# EAGLE schematic Memory Board (EAGLE 7.4.0)
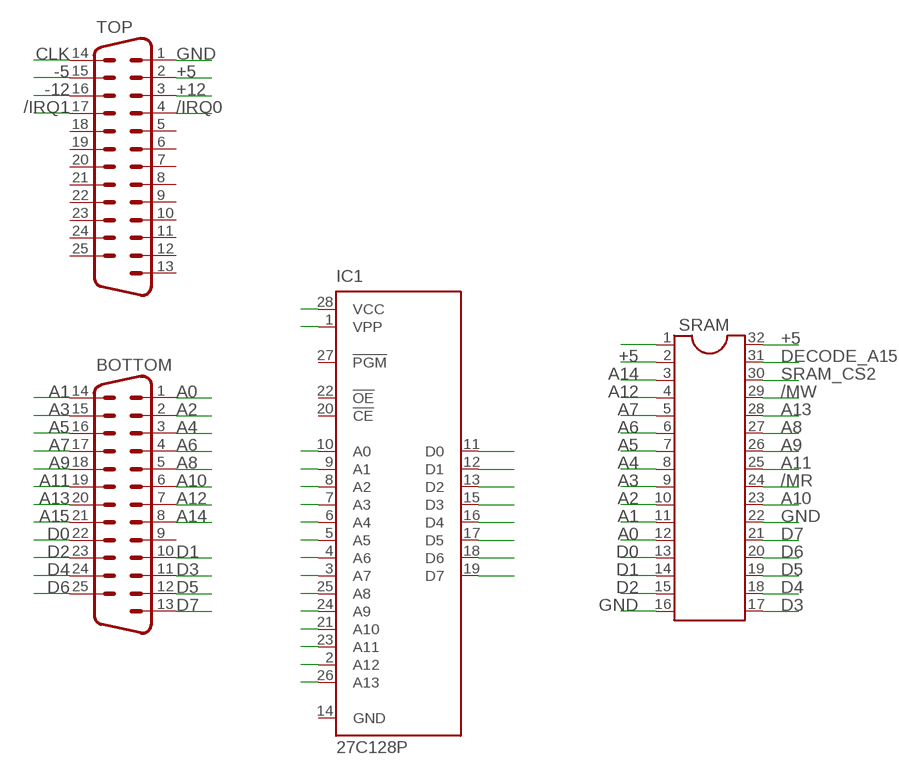
[diagram p0: schematic, sheet 1]

## Parts
BOTTOM  M25H  [M25H]
IC1  27C128P  [DIL28-6]
SRAM  DIL32  [DIL32]
TOP  M25H  [M25H]

## Nets
+5: IC1.28(VCC) SRAM.2 SRAM.32 TOP.2
+12: TOP.3
-5: TOP.15
-12: TOP.16
/IRQ0: TOP.4
/IRQ1: TOP.17
/MR: SRAM.24
/MW: SRAM.29
A0: BOTTOM.1 IC1.10(A0) SRAM.12
A1: BOTTOM.14 IC1.9(A1) SRAM.11
A2: BOTTOM.2 IC1.8(A2) SRAM.10
A3: BOTTOM.15 IC1.7(A3) SRAM.9
A4: BOTTOM.3 IC1.6(A4) SRAM.8
A5: BOTTOM.16 IC1.5(A5) SRAM.7
A6: BOTTOM.4 IC1.4(A6) SRAM.6
A7: BOTTOM.17 IC1.3(A7) SRAM.5
A8: BOTTOM.5 IC1.25(A8) SRAM.27
A9: BOTTOM.18 IC1.24(A9) SRAM.26
A10: BOTTOM.6 IC1.21(A10) SRAM.23
A11: BOTTOM.19 IC1.23(A11) SRAM.25
A12: BOTTOM.7 IC1.2(A12) SRAM.4
A13: BOTTOM.20 IC1.26(A13) SRAM.28
A14: BOTTOM.8 SRAM.3
A15: BOTTOM.21
CLK: TOP.14
D0: BOTTOM.22 IC1.11(D0) SRAM.13
D1: BOTTOM.10 IC1.12(D1) SRAM.14
D2: BOTTOM.23 IC1.13(D2) SRAM.15
D3: BOTTOM.11 IC1.15(D3) SRAM.17
D4: BOTTOM.24 IC1.16(D4) SRAM.18
D5: BOTTOM.12 IC1.17(D5) SRAM.19
D6: BOTTOM.25 IC1.18(D6) SRAM.20
D7: BOTTOM.13 IC1.19(D7) SRAM.21
DECODE_A15: SRAM.31
GND: IC1.1(VPP) SRAM.16 SRAM.22 TOP.1
N$16: SRAM.1
SRAM_CS2: SRAM.30
Unconnected: BOTTOM.9 IC1.20(!CE) IC1.22(!OE) IC1.27(!PGM) TOP.5 TOP.6 TOP.7 TOP.8 TOP.9 TOP.10 TOP.11 TOP.12 TOP.13 TOP.18 TOP.19 TOP.20 TOP.21 TOP.22 TOP.23 TOP.24 TOP.25

## Power pins joined to a net without a drawn wire
GND: IC1.14(GND)

## Library data of the parts
BOTTOM TOP = con-subd:M25: SUB-D; OC_FARNELL: unknown; OC_NEWARK: unknown
IC1 = microchip:27*128: CMOS EPROM 128 K (16 K x 8); OC_FARNELL: unknown; OC_NEWARK: unknown
SRAM = ic-package:DIL32: Dual In Line